# EAGLE design untitled (EAGLE 7.2.0)
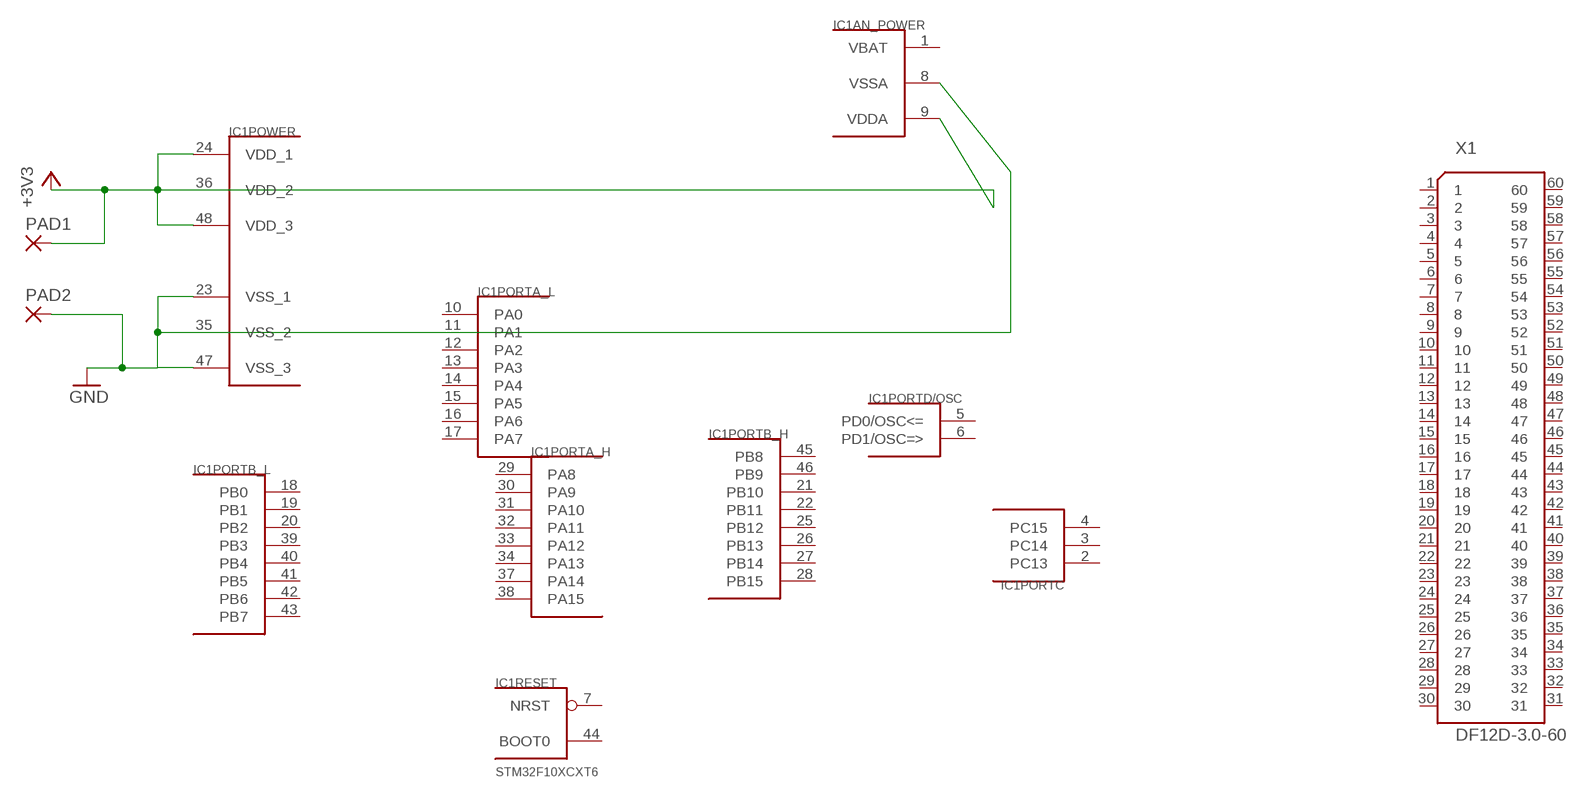
[diagram p0: schematic, sheet 1]

## Parts
IC1  STM32F10XCXT6  [TQFP48]
PAD1  1,6/0,8  [1,6/0,8]
PAD2  1,6/0,8  [1,6/0,8]
X1  DF12D-3.0-60  [DF12-3.0-60]

## Nets
+3V3: IC1.9(AN_POWER:VDDA) IC1.24(POWER:VDD_1) IC1.36(POWER:VDD_2) IC1.48(POWER:VDD_3) PAD1.1(P)
GND: IC1.8(AN_POWER:VSSA) IC1.23(POWER:VSS_1) IC1.35(POWER:VSS_2) IC1.47(POWER:VSS_3) PAD2.1(P)
Unconnected: IC1.2(PORTC:PC13) IC1.3(PORTC:PC14) IC1.4(PORTC:PC15) IC1.5(PORTD/OSC:PD0/OSC<=) IC1.6(PORTD/OSC:PD1/OSC=>) IC1.7(RESET:NRST) IC1.10(PORTA_L:PA0) IC1.11(PORTA_L:PA1) IC1.12(PORTA_L:PA2) IC1.13(PORTA_L:PA3) IC1.14(PORTA_L:PA4) IC1.15(PORTA_L:PA5) IC1.16(PORTA_L:PA6) IC1.17(PORTA_L:PA7) IC1.18(PORTB_L:PB0) IC1.19(PORTB_L:PB1) IC1.20(PORTB_L:PB2) IC1.21(PORTB_H:PB10) IC1.22(PORTB_H:PB11) IC1.25(PORTB_H:PB12) IC1.26(PORTB_H:PB13) IC1.27(PORTB_H:PB14) IC1.28(PORTB_H:PB15) IC1.29(PORTA_H:PA8) IC1.30(PORTA_H:PA9) IC1.31(PORTA_H:PA10) IC1.32(PORTA_H:PA11) IC1.33(PORTA_H:PA12) IC1.34(PORTA_H:PA13) IC1.37(PORTA_H:PA14) IC1.38(PORTA_H:PA15) IC1.39(PORTB_L:PB3) IC1.40(PORTB_L:PB4) IC1.41(PORTB_L:PB5) IC1.42(PORTB_L:PB6) IC1.43(PORTB_L:PB7) IC1.44(RESET:BOOT0) IC1.45(PORTB_H:PB8) IC1.46(PORTB_H:PB9) X1.1 X1.2 X1.3 X1.4 X1.5 X1.6 X1.7 X1.8 X1.9 X1.10 X1.11 X1.12 X1.13 X1.14 X1.15 X1.16 X1.17 X1.18 X1.19 X1.20 X1.21 X1.22 X1.23 X1.24 X1.25 X1.26 X1.27 X1.28 X1.29 X1.30 X1.31 X1.32 X1.33 X1.34 X1.35 X1.36 X1.37 X1.38 X1.39 X1.40 X1.41 X1.42 X1.43 X1.44 X1.45 X1.46 X1.47 X1.48 X1.49 X1.50 X1.51 X1.52 X1.53 X1.54 X1.55 X1.56 X1.57 X1.58 X1.59 X1.60

## Power pins joined to a net without a drawn wire
VBAT: IC1.1(AN_POWER:VBAT)

## Library data of the parts
IC1 = stm32:STM32F10XCXT6: ST STM32F101/103 48pin LQFP
PAD1 PAD2 = wirepad:1,6/0,8: THROUGH-HOLE PAD
X1 = con-hirose:DF12D-3.0-60: 60 pin connector PN: DF12D(3.0)-60DP-0.5V Source: con-hirose-df12d(3.0)60dp0.5v80.lbr from Bob Starr <rtzaudio@mindspring.com>; OC_FARNELL: unknown; OC_NEWARK: unknown

## Board
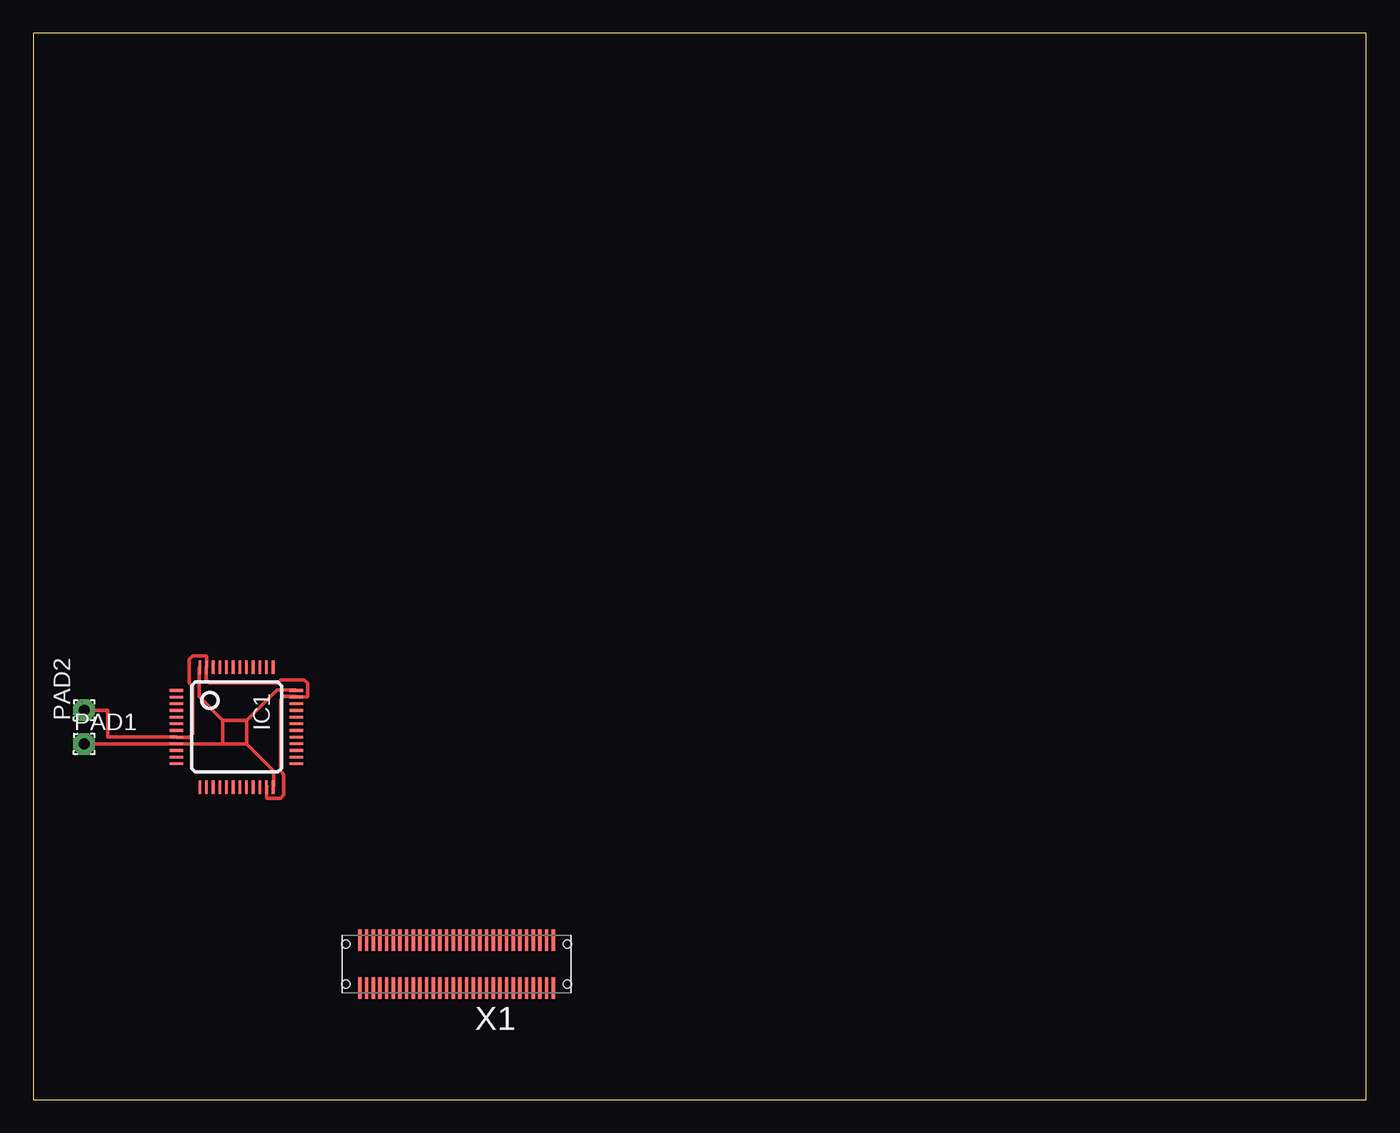
[diagram p1: board, top side]

Size 100 x 80 mm. Coordinates in mm from the lower left corner, seen from the top.
Outline: 0,0 100,0 100,80 0,80 0,0
Copper layers (1*16): Top 0.035mm / dielectric 1.5mm / Bottom 0.035mm
Design rules "default": minimum track width 10mil, minimum drill 24mil, track to track 8mil, track to pad 8mil, pad to pad 8mil, via to via 8mil, smd to smd 8mil, copper to edge 40mil, drill to drill 8mil, minimum pad ring 10mil, minimum via ring 8mil, stop-mask expansion 4mil, vias tented up to drill 0mil, thermal gap 10mil

### Footprints (pad centres in the part's own frame; a part is rotated, then mirrored left to right if it is on the bottom)
TQFP48 = smd 0.2 x 1: 1 -2.75,-4.5; 2 -2.25,-4.5; 3 -1.75,-4.5; 4 -1.25,-4.5; 5 -0.75,-4.5; 6 -0.25,-4.5; 7 0.25,-4.5; 8 0.75,-4.5; 9 1.25,-4.5; 10 1.75,-4.5; 11 2.25,-4.5; 12 2.75,-4.5; 25 2.75,4.5; 26 2.25,4.5; 27 1.75,4.5; 28 1.25,4.5; 29 0.75,4.5; 30 0.25,4.5; 31 -0.25,4.5; 32 -0.75,4.5; 33 -1.25,4.5; 34 -1.75,4.5; 35 -2.25,4.5; 36 -2.75,4.5 | smd 1 x 0.2: 13 4.5,-2.75; 14 4.5,-2.25; 15 4.5,-1.75; 16 4.5,-1.25; 17 4.5,-0.75; 18 4.5,-0.25; 19 4.5,0.25; 20 4.5,0.75; 21 4.5,1.25; 22 4.5,1.75; 23 4.5,2.25; 24 4.5,2.75; 37 -4.5,2.75; 38 -4.5,2.25; 39 -4.5,1.75; 40 -4.5,1.25; 41 -4.5,0.75; 42 -4.5,0.25; 43 -4.5,-0.25; 44 -4.5,-0.75; 45 -4.5,-1.25; 46 -4.5,-1.75; 47 -4.5,-2.25; 48 -4.5,-2.75
1,6/0,8 = drill 0.813 pad 1.6 octagon: 1 0,0
DF12-3.0-60 = smd 1.6 x 0.25: 1 1.8,7.25; 2 1.8,6.75; 3 1.8,6.25; 4 1.8,5.75; 5 1.8,5.25; 6 1.8,4.75; 7 1.8,4.25; 8 1.8,3.75; 9 1.8,3.25; 10 1.8,2.75; 11 1.8,2.25; 12 1.8,1.75; 13 1.8,1.25; 14 1.8,0.75; 15 1.8,0.25; 16 1.8,-0.25; 17 1.8,-0.75; 18 1.8,-1.25; 19 1.8,-1.75; 20 1.8,-2.25; 21 1.8,-2.75; 22 1.8,-3.25; 23 1.8,-3.75; 24 1.8,-4.25; 25 1.8,-4.75; 26 1.8,-5.25; 27 1.8,-5.75; 28 1.8,-6.25; 29 1.8,-6.75; 30 1.8,-7.25; 31 -1.8,-7.25; 32 -1.8,-6.75; 33 -1.8,-6.25; 34 -1.8,-5.75; 35 -1.8,-5.25; 36 -1.8,-4.75; 37 -1.8,-4.25; 38 -1.8,-3.75; 39 -1.8,-3.25; 40 -1.8,-2.75; 41 -1.8,-2.25; 42 -1.8,-1.75; 43 -1.8,-1.25; 44 -1.8,-0.75; 45 -1.8,-0.25; 46 -1.8,0.25; 47 -1.8,0.75; 48 -1.8,1.25; 49 -1.8,1.75; 50 -1.8,2.25; 51 -1.8,2.75; 52 -1.8,3.25; 53 -1.8,3.75; 54 -1.8,4.25; 55 -1.8,4.75; 56 -1.8,5.25; 57 -1.8,5.75; 58 -1.8,6.25; 59 -1.8,6.75; 60 -1.8,7.25 | hole 0.6: -1.5,8.3; 1.5,8.3; 1.5,-8.3; -1.5,-8.3

### Placement (x,y rotation side)
IC1  15.24,27.94 270 top
PAD1  3.81,26.67 0 top
PAD2  3.81,29.21 90 top
X1  31.75,10.16 90 top

### Tracks (layer width: path | path; a pad name or v marks a point on that pad's centre or on a via)
+3V3
  Top 0.254: PAD1.1 3.81,26.69 IC1.9 10.76,26.67 14.22,26.67 | IC1.48 12.45,32.4 12.45,30.23 14.22,28.45 | IC1.36 19.7,30.73 18.29,30.73 16,28.45 | 14.22,28.45 16,28.45 | IC1.24 18.03,23.48 18.03,24.64 16,26.67 | 16,28.45 16,26.67 | 16,26.67 14.22,26.67 | 14.22,26.67 14.22,28.45
GND
  Top 0.254: PAD2.1 5.59,29.21 5.59,27.19 IC1.8 10.75,27.18 11.68,27.18 11.94,27.43 11.94,30.99 11.68,31.24 11.68,33.02 11.94,33.27 12.95,33.27 12.99,33.24 IC1.47 12.95,32.4 12.95,31.5 13.21,31.24 18.29,31.24 18.54,31.5 20.32,31.5 20.57,31.24 20.57,30.23 20.54,30.19 IC1.35 19.7,30.23 18.8,30.23 18.54,29.97 18.54,24.64 18.8,24.38 18.8,22.86 18.54,22.61 17.53,22.61 17.49,22.64 IC1.23 17.53,23.48